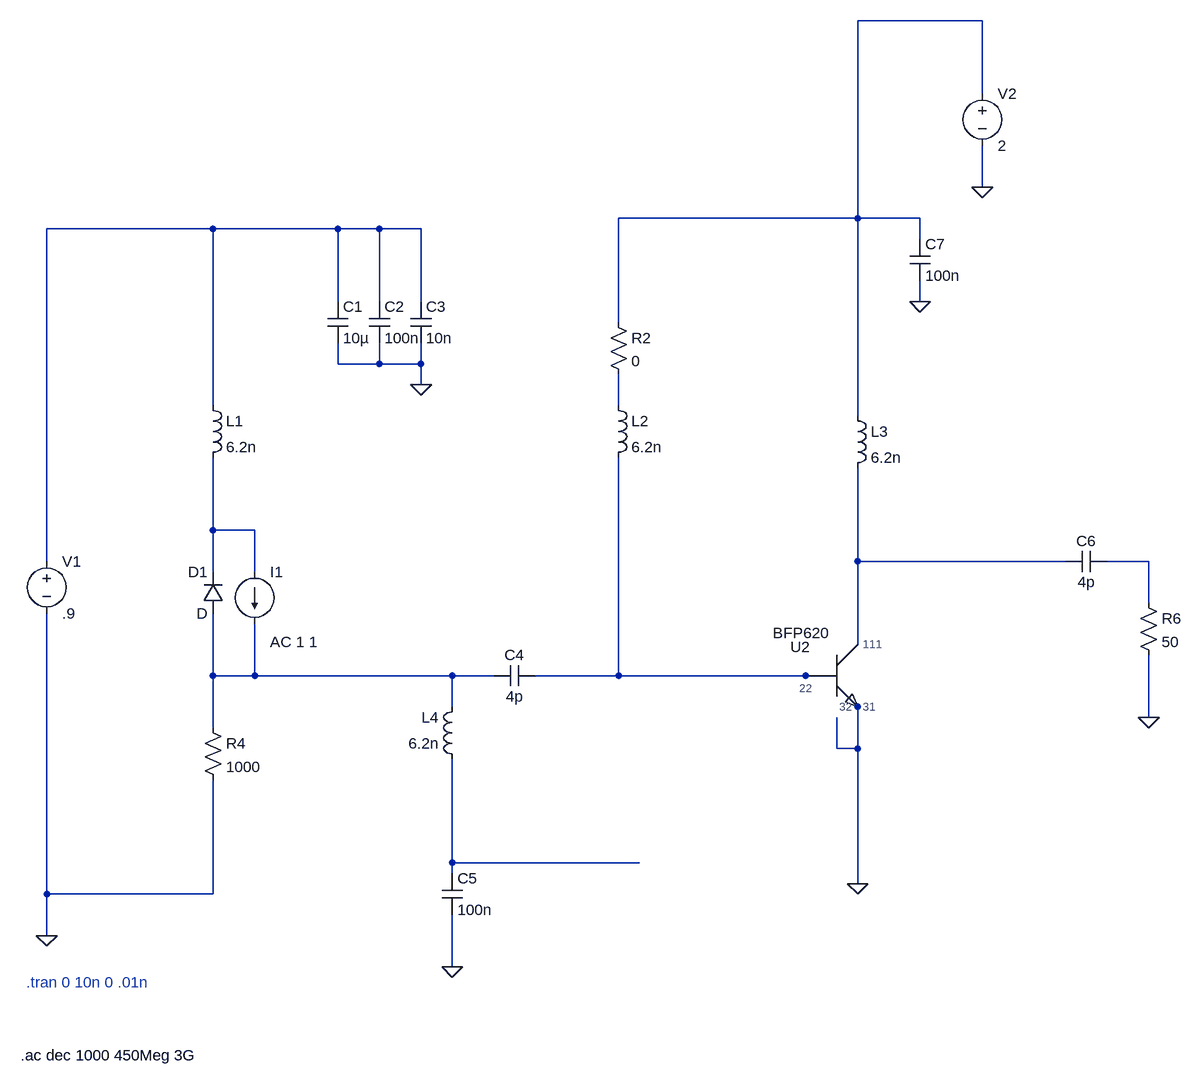
[diagram p0: schematic Draft2.asc]
Draft2.asc, the LTspice schematic file:
Version 4.1
SHEET 1 1544 904
WIRE 1232 -704 1040 -704
WIRE 1232 -592 1232 -704
WIRE 1232 -448 1232 -512
WIRE 1040 -400 1040 -704
WIRE 1040 -400 672 -400
WIRE 1136 -400 1040 -400
WIRE 48 -384 -208 -384
WIRE 240 -384 48 -384
WIRE 304 -384 240 -384
WIRE 368 -384 304 -384
WIRE 1136 -368 1136 -400
WIRE 240 -272 240 -384
WIRE 304 -272 304 -384
WIRE 368 -272 368 -384
WIRE 1136 -272 1136 -304
WIRE 672 -240 672 -400
WIRE 240 -176 240 -208
WIRE 304 -176 304 -208
WIRE 304 -176 240 -176
WIRE 368 -176 368 -208
WIRE 368 -176 304 -176
WIRE 368 -144 368 -176
WIRE 48 -112 48 -384
WIRE 672 -112 672 -160
WIRE 1040 -96 1040 -400
WIRE 48 80 48 -32
WIRE 112 80 48 80
WIRE -208 128 -208 -384
WIRE 1040 128 1040 -16
WIRE 1360 128 1040 128
WIRE 1488 128 1424 128
WIRE 48 144 48 80
WIRE 112 144 112 80
WIRE 1488 192 1488 128
WIRE 1040 256 1040 128
WIRE 48 304 48 208
WIRE 112 304 112 224
WIRE 112 304 48 304
WIRE 416 304 112 304
WIRE 480 304 416 304
WIRE 672 304 672 -32
WIRE 672 304 544 304
WIRE 960 304 672 304
WIRE 992 304 960 304
WIRE 416 352 416 304
WIRE 1488 368 1488 272
WIRE 48 384 48 304
WIRE 1008 416 1008 368
WIRE 1040 416 1040 352
WIRE 1040 416 1008 416
WIRE 416 592 416 432
WIRE 704 592 416 592
WIRE 416 608 416 592
WIRE 1040 624 1040 416
WIRE -208 640 -208 208
WIRE 48 640 48 464
WIRE 48 640 -208 640
WIRE -208 704 -208 640
WIRE 416 752 416 672
FLAG 368 -144 0
FLAG -208 704 0
FLAG 416 752 0
FLAG 1232 -448 0
FLAG 1040 624 0
FLAG 1488 368 0
FLAG 1136 -272 0
DATAFLAG 672 592 ""
DATAFLAG 560 592 ""
SYMBOL diode 64 208 R180
WINDOW 0 24 64 Left 2
WINDOW 3 24 0 Left 2
SYMATTR InstName D1
SYMBOL voltage -208 112 R0
WINDOW 123 0 0 Left 0
WINDOW 39 0 0 Left 0
SYMATTR InstName V1
SYMATTR Value .9
SYMBOL ind 32 -128 R0
SYMATTR InstName L1
SYMATTR Value 6.2n
SYMATTR SpiceLine Rser=.5
SYMBOL cap 224 -272 R0
SYMATTR InstName C1
SYMATTR Value 10µ
SYMBOL cap 288 -272 R0
SYMATTR InstName C2
SYMATTR Value 100n
SYMBOL cap 352 -272 R0
SYMATTR InstName C3
SYMATTR Value 10n
SYMBOL ind 656 -128 R0
SYMATTR InstName L2
SYMATTR Value 6.2n
SYMATTR SpiceLine Rser=.5
SYMBOL res 656 -256 R0
SYMATTR InstName R2
SYMATTR Value 0
SYMBOL ind 1024 -112 R0
SYMATTR InstName L3
SYMATTR Value 6.2n
SYMATTR SpiceLine Rser=.5
SYMBOL current 112 144 R0
WINDOW 123 24 108 Left 2
WINDOW 39 0 0 Left 0
SYMATTR Value2 AC 1 1
SYMATTR InstName I1
SYMATTR Value ""
SYMBOL res 32 368 R0
SYMATTR InstName R4
SYMATTR Value 1000
SYMBOL cap 544 288 R90
WINDOW 0 0 32 VBottom 2
WINDOW 3 32 32 VTop 2
SYMATTR InstName C4
SYMATTR Value 4p
SYMBOL ind 432 448 R180
WINDOW 0 36 80 Left 2
WINDOW 3 36 40 Left 2
SYMATTR InstName L4
SYMATTR Value 6.2n
SYMBOL cap 400 608 R0
SYMATTR InstName C5
SYMATTR Value 100n
SYMBOL voltage 1232 -608 R0
WINDOW 123 0 0 Left 0
WINDOW 39 0 0 Left 0
SYMATTR InstName V2
SYMATTR Value 2
SYMBOL cap 1424 112 R90
WINDOW 0 0 32 VBottom 2
WINDOW 3 32 32 VTop 2
SYMATTR InstName C6
SYMATTR Value 4p
SYMBOL res 1472 176 R0
SYMATTR InstName R6
SYMATTR Value 50
SYMBOL cap 1120 -368 R0
SYMATTR InstName C7
SYMATTR Value 100n
SYMBOL BFP620 1024 304 R0
SYMATTR InstName U2
TEXT -240 776 Left 2 ;.tran 0 10n 0 .01n
TEXT -248 888 Left 2 !.ac dec 1000 450Meg 3G

The netlist it stands for:
* Draft2.asc
D1 N007 N004 D
V1 N002 0 .9
L1 N002 N004 6.2n Rser=.5
C1 N002 0 10µ
C2 N002 0 100n
C3 N002 0 10n
L2 N003 N008 6.2n Rser=.5
R2 N001 N003 0
L3 N001 N005 6.2n Rser=.5
I1 N004 N007 AC 1 1
R4 N007 0 1000
C4 N008 N007 4p
L4 N009 N007 6.2n
C5 N009 0 100n
V2 N001 0 2
C6 N006 N005 4p
R6 N006 0 50
C7 N001 0 100n
X§U2 N005 N008 0 0 BFP620  ; pins 111 22 31 32
.model D D
.lib standard.dio
* .tran 0 10n 0 .01n
.ac dec 1000 450Meg 3G
.lib C:\Users\andre\Downloads\infineon-rftransistor-spice.lib-simulationmodels-en.lib
.backanno
.end